# Altium schematic sheet Sheet2.SchDoc
size A2
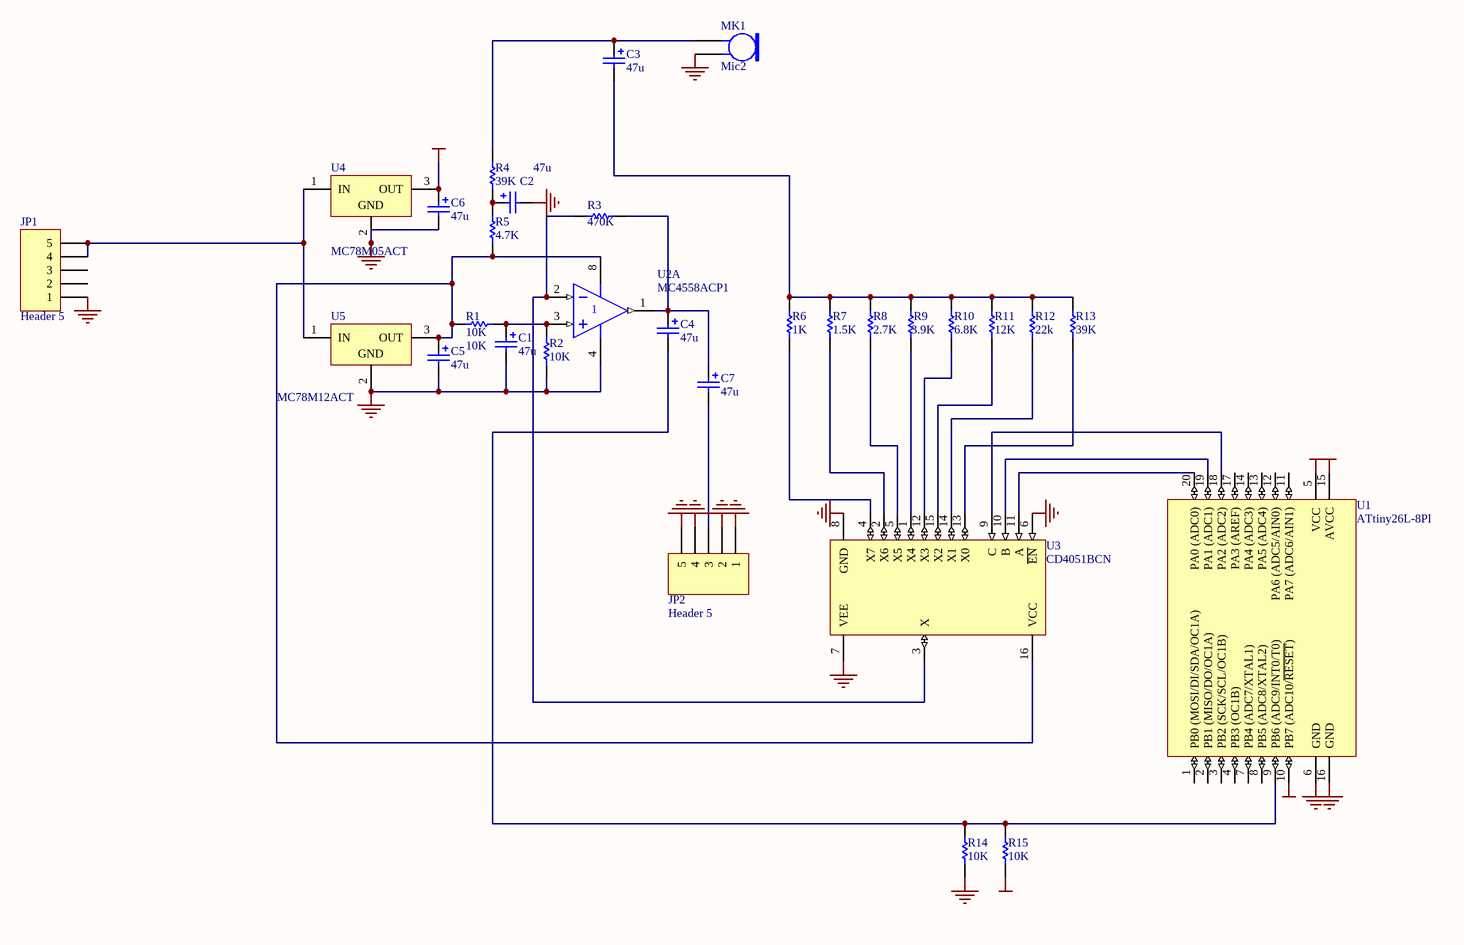
[diagram p0: Sheet2.SchDoc]

## Parts
C1  47u  [CAPPR2-5X6.8]
C2  47u  [CAPPR2-5X6.8]
C3  47u  [CAPPR2-5X6.8]
C4  47u  [CAPPR2-5X6.8]
C5  47u  [CAPPR2-5X6.8]
C6  47u  [CAPPR2-5X6.8]
C7  47u  [CAPPR2-5X6.8]
JP1  Header 5  [HDR1X5]
JP2  Header 5  [HDR1X5]
MK1  Mic2  [PIN2]
R1  10K  [AXIAL-0.3]
R2  10K  [AXIAL-0.3]
R3  470K  [AXIAL-0.3]
R4  39K  [AXIAL-0.3]
R5  4.7K  [AXIAL-0.3]
R6  1K  [AXIAL-0.3]
R7  1.5K  [AXIAL-0.3]
R8  2.7K  [AXIAL-0.3]
R9  3.9K  [AXIAL-0.3]
R10  6.8K  [AXIAL-0.3]
R11  12K  [AXIAL-0.3]
R12  22k  [AXIAL-0.3]
R13  39K  [AXIAL-0.3]
R14  10K  [AXIAL-0.3]
R15  10K  [AXIAL-0.3]
U1  ATtiny26L-8PI  [20P3]
U2  MC4558ACP1  [626-05]  (part A of 2)
U3  CD4051BCN  [N16E]
U4  MC78M05ACT  [221A-09]
U5  MC78M12ACT  [221A-09]

## Nets
GND: C1.2 C2.2 C5.2 C6.2 JP1.1 JP2.1 JP2.2 JP2.4 JP2.5 MK1.2 R2.1 R14.1 U1.6(GND) U1.16(GND) U2.4(V-) U3.6(~{EN}) U3.7(VEE) U3.8(GND) U4.2(GND) U5.2(GND)
VCC: C6.1 R15.1 U1.5(VCC) U1.10(PB7_(ADC10/~{RESET})) U1.15(AVCC) U4.3(OUT)
NetC1_1: C1.1 R1.1 R2.2 U2.3(IN+)
NetC2_1: C2.1 R4.1 R5.2
NetC3_1: C3.1 MK1.1 R4.2
NetC3_2: C3.2 R6.2 R7.2 R8.2 R9.2 R10.2 R11.2 R12.2 R13.2
NetC4_1: C4.1 C7.1 R3.2 U2.1(OUT)
NetC4_2: C4.2 R14.2 R15.2 U1.9(PB6_(ADC9/INT0/T0))
NetC5_1: C5.1 R1.2 R5.1 U2.8(V+) U3.16(VCC) U5.3(OUT)
NetC7_2: C7.2 JP2.3
NetJP1_4: JP1.4 JP1.5 U4.1(IN) U5.1(IN)
NetR3_1: R3.1 U2.2(IN-) U3.3(X)
NetR6_1: R6.1 U3.4(X7)
NetR7_1: R7.1 U3.2(X6)
NetR8_1: R8.1 U3.5(X5)
NetR9_1: R9.1 U3.1(X4)
NetR10_1: R10.1 U3.12(X3)
NetR11_1: R11.1 U3.15(X2)
NetR12_1: R12.1 U3.14(X1)
NetR13_1: R13.1 U3.13(X0)
NetU1_18: U1.18(PA2_(ADC2)) U3.9(C)
NetU1_19: U1.19(PA1_(ADC1)) U3.10(B)
NetU1_20: U1.20(PA0_(ADC0)) U3.11(A)

Not connected (* = marked no-connect by the designer): JP1 2 3; U1 1(PB0_(MOSI/DI/SDA/OC1A)) 2(PB1_(MISO/DO/OC1A)) 3(PB2_(SCK/SCL/OC1B)) 4(PB3_(OC1B)) 7(PB4_(ADC7/XTAL1)) 8(PB5_(ADC8/XTAL2)) 11(PA7_(ADC6/AIN1)) 12(PA6_(ADC5/AIN0)) 13(PA5_(ADC4)) 14(PA4_(ADC3)) 17(PA3_(AREF))

## Library data of the parts
C1 C2 C5 C6 = Cap Pol1: Polarized Capacitor (Radial); Value: 1u; Published: 8-Jun-2000; Revision: July-2002: Re-released for DXP Platform.; Publisher: Altium Limited
C3 C4 C7 = Cap Pol1: Polarized Capacitor (Radial); Published: 8-Jun-2000; Revision: July-2002: Re-released for DXP Platform.; Publisher: Altium Limited
JP1 JP2 = Header 5: Header, 5-Pin; Revision: 17-Jul-2002: Re-released for DXP Platform.; Publisher: Altium Limited
MK1 = Mic2: Microphone; Published: 24-Mar-1999; Revision: July-2002: Re-released for DXP Platform.; Publisher: Altium Limited
R1-R15 = Res1: Resistor; Published: 8-Jun-2000; Revision: July-2002: Re-released for DXP Platform.; Publisher: Altium Limited
  R1: Value: 10K
U1 = ATtiny26L-8PI: 8-Bit AVR Microcontroller with 2K Bytes of Flash Memory; Package Information: Latest Revision: Aug-1999; Code - JEDEC: MS-001-AD; Published: 17-Sep-2003; Datasheet: Latest Revision: 1477C-AVR-09/02; Package Reference: 20P3; Publisher: Altium Limited
U2 = MC4558ACP1: Dual High-Frequency Operational Amplifier; Published: 17-Jul-2002; Revision: 23-Sep-2002: SIM Model Added.; Datasheet: Linear and Interface Integrated Circuits, DL128 Rev2 (1988); Package Reference: 626-05; Publisher: Altium Limited
U3 = CD4051BCN: 8-Channel Analog Multiplexer/Demultiplexer; Package Information: Latest Revision: 2000; Published: 17-Jul-2002; Datasheet: Latest Revision: Jan-1999; Package Reference: N16E; Publisher: Altium Limited
U4 U5 = MC78M05ACT: Three-Terminal Medium Current Positive Voltage Regulator; Note: Heatsink surface connected to Pin 2; Code - JEDEC: TO-262-AA; Published: 15-Apr-2002; Datasheet: Latest Revision: Apr-2000; Package Reference: 221A-09; Publisher: Altium Limited